# Altium project MDK_UltraZohm_Adapter.PrjPcb
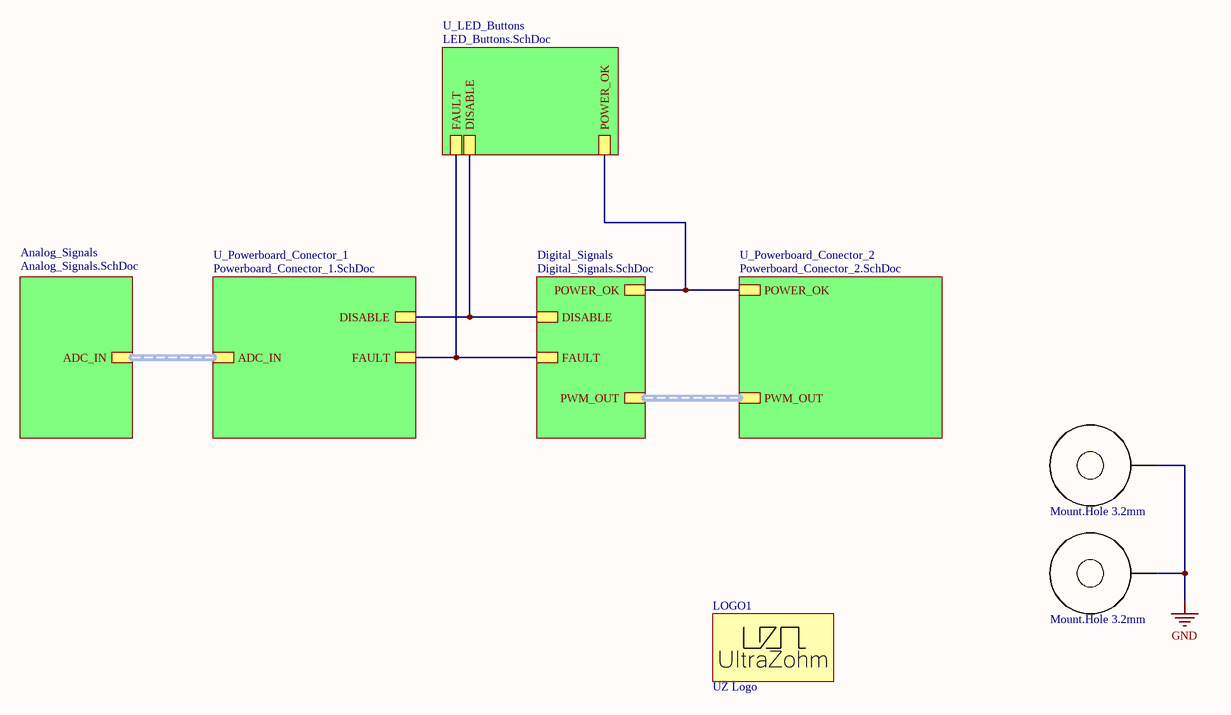
[diagram p0: Interface_Board_Top.SchDoc]
ProjectRevision: Rev02; ProjectName: UZ_OnSemi_Adapter; GlobalAuthor: Eyke Liegmann; GlobalApprovedBy: Daniel Pruna; Date: 03/2021; AuthorParam: Eugen Romaschenko
6 sheets, 41 parts. Net scope: hierarchical (ports join the sheet entries above them; power ports are global).
Board file: MDK_UltraZohm_Adapter.PcbDoc
Sheets:
  Interface_Board_Top.SchDoc
    Analog_Signals = Analog_Signals.SchDoc
    Digital_Signals = Digital_Signals.SchDoc
    U_LED_Buttons = LED_Buttons.SchDoc
    U_Powerboard_Conector_1 = Powerboard_Conector_1.SchDoc
    U_Powerboard_Conector_2 = Powerboard_Conector_2.SchDoc

## Sheet Interface_Board_Top.SchDoc
size A4; Author: Eugen Romaschenko; CompanyName: Technische Hochschule Nürnberg Georg Simon Ohm; Organization: UltraZohm; Address1: Kesslerplatz 12; Address2: 90489 Nürnberg; Address3: GERMANY; DocumentNumber: 1; SheetNumber: 1; SheetTotal: 6; Website: www.ultrazohm.com

### Parts
H1  Mount.Hole 3.2mm  [MHole3_2mm_No_Screw]  (no BOM)
H2  Mount.Hole 3.2mm  [MHole3_2mm_No_Screw]  (no BOM)
LOGO1  UZ Logo  [UZ_Logo_tiny]  (no BOM)

### Sub-sheets
Analog_Signals = Analog_Signals.SchDoc: ADC_IN (harness ADC_IN)
Digital_Signals = Digital_Signals.SchDoc: POWER_OK, FAULT, DISABLE, PWM_OUT (harness PWM_OUT)
U_LED_Buttons = LED_Buttons.SchDoc: POWER_OK, DISABLE, FAULT
U_Powerboard_Conector_1 = Powerboard_Conector_1.SchDoc: FAULT, DISABLE, ADC_IN (harness ADC_IN)
U_Powerboard_Conector_2 = Powerboard_Conector_2.SchDoc: PWM_OUT (harness PWM_OUT), POWER_OK

### Nets
GND: H1.1 H2.1
DISABLE: sheet Digital_Signals/DISABLE, sheet U_LED_Buttons/DISABLE, sheet U_Powerboard_Conector_1/DISABLE
FAULT: sheet Digital_Signals/FAULT, sheet U_LED_Buttons/FAULT, sheet U_Powerboard_Conector_1/FAULT
POWER_OK: sheet Digital_Signals/POWER_OK, sheet U_LED_Buttons/POWER_OK, sheet U_Powerboard_Conector_2/POWER_OK

### Buses and harness runs
harness sheet Analog_Signals/ADC_IN = sheet U_Powerboard_Conector_1/ADC_IN
harness sheet Digital_Signals/PWM_OUT = sheet U_Powerboard_Conector_2/PWM_OUT

### Notes on the sheet
- Title
- Revision:
- Design Engineer:
- Date:
- Project:
- Sheet
- of

### Library data of the parts
H1 H2 = MHole: AN: 22898; Mixed: THT
LOGO1 = UZ Logo: UltraZohm Logo on PCB; Created: Jan2021_Liegmann; Value: UZ Logo

## Sheet Analog_Signals.SchDoc
size A4; Author: Eugen Romaschenko; CompanyName: Technische Hochschule Nürnberg Georg Simon Ohm; Organization: UltraZohm; Address1: Kesslerplatz 12; Address2: 90489 Nürnberg; Address3: GERMANY; DocumentNumber: 2; SheetNumber: 2; SheetTotal: 6; Website: www.ultrazohm.com
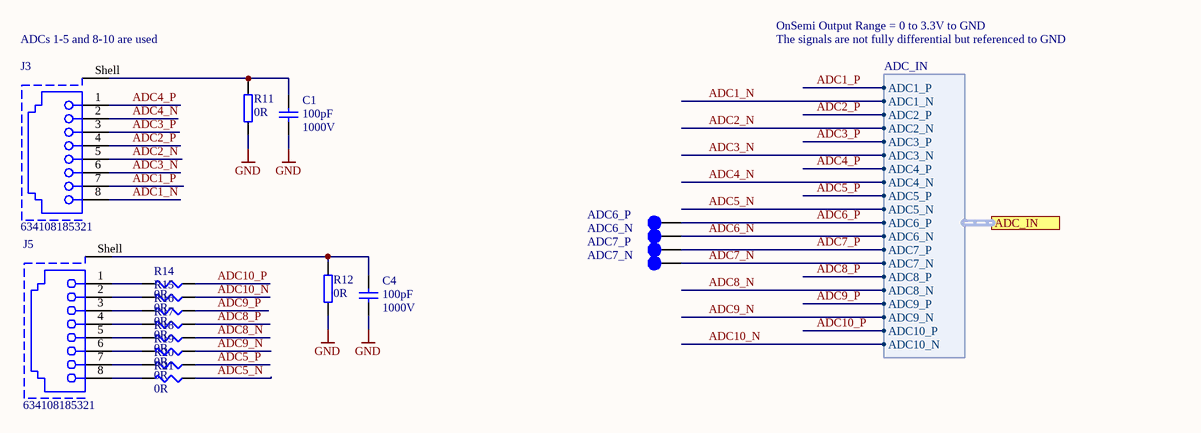
[diagram p1: Analog_Signals.SchDoc]

### Parts
ADC6_N  ADC6_N  [TP_1mm]  (value not drawn)  (no BOM)
ADC6_P  ADC6_P  [TP_1mm]  (value not drawn)  (no BOM)
ADC7_N  ADC7_N  [TP_1mm]  (value not drawn)  (no BOM)
ADC7_P  ADC7_P  [TP_1mm]  (value not drawn)  (no BOM)
C1  100pF  Voltage: 1000V  [C_1206]
C4  100pF  Voltage: 1000V  [C_1206]
J3  634108185321  [634108185321]
J5  634108185321  [634108185321]
R11  0R  [RESC1608X06N]
R12  0R  [RESC1608X06N]
R14  0R  [RESC0603]
R15  0R  [RESC0603]
R16  0R  [RESC0603]
R17  0R  [RESC0603]
R18  0R  [RESC0603]
R19  0R  [RESC0603]
R20  0R  [RESC0603]
R21  0R  [RESC0603]

### Ports
ADC_IN (harness ADC_IN)

### Harnesses
ADC_IN: ADC10_N, ADC10_P, ADC1_N, ADC1_P, ADC2_N, ADC2_P, ADC3_N, ADC3_P, ADC4_N, ADC4_P, ADC5_N, ADC5_P, ADC6_N, ADC6_P, ADC7_N, ADC7_P, ADC8_N, ADC8_P, ADC9_N, ADC9_P

### Nets
GND: C1.1 C4.1 R11.1 R12.1
ADC1_N: J3.8 ; port ADC_IN.ADC1_N
ADC1_P: J3.7 ; port ADC_IN.ADC1_P
ADC2_N: J3.5 ; port ADC_IN.ADC2_N
ADC2_P: J3.4 ; port ADC_IN.ADC2_P
ADC3_N: J3.6 ; port ADC_IN.ADC3_N
ADC3_P: J3.3 ; port ADC_IN.ADC3_P
ADC4_N: J3.2 ; port ADC_IN.ADC4_N
ADC4_P: J3.1 ; port ADC_IN.ADC4_P
ADC5_N: R21.1 ; port ADC_IN.ADC5_N
ADC5_P: R20.1 ; port ADC_IN.ADC5_P
ADC6_N: ADC6_N.1 ; port ADC_IN.ADC6_N
ADC6_P: ADC6_P.1 ; port ADC_IN.ADC6_P
ADC7_N: ADC7_N.1 ; port ADC_IN.ADC7_N
ADC7_P: ADC7_P.1 ; port ADC_IN.ADC7_P
ADC8_N: R18.1 ; port ADC_IN.ADC8_N
ADC8_P: R17.1 ; port ADC_IN.ADC8_P
ADC9_N: R19.1 ; port ADC_IN.ADC9_N
ADC9_P: R16.1 ; port ADC_IN.ADC9_P
ADC10_N: R15.1 ; port ADC_IN.ADC10_N
ADC10_P: R14.1 ; port ADC_IN.ADC10_P
NetC1_2: C1.2 J3.Shell R11.2
NetC4_2: C4.2 J5.Shell R12.2
NetJ5_1: J5.1 R14.2
NetJ5_2: J5.2 R15.2
NetJ5_3: J5.3 R16.2
NetJ5_4: J5.4 R17.2
NetJ5_5: J5.5 R18.2
NetJ5_6: J5.6 R19.2
NetJ5_7: J5.7 R20.2
NetJ5_8: J5.8 R21.2

### Notes on the sheet
- (near J3) ADCs 1-5 and 8-10 are used
- OnSemi Output Range = 0 to 3.3V to GND
- The signals are not fully differential but referenced to GND
- Title
- Revision:
- Design Engineer:
- Date:
- Project:
- Sheet
- of

### Library data of the parts
ADC6_N ADC6_P ADC7_N ADC7_P = TP_1mm: Testpoint 1mm; Created: 2018_06_25_AGeiger; Value: Testpoint 1mm
C1 C4 = C_1206: Capacitor 1206; MPN: 885342008009; Tolerance: 5%; MF: Würth Elektronik; Dielectric: C0G; Package: 1206; Value: 100pF; Created: 2018_06_25_AGeiger; Supplier 1: Mouser; Supplier Part Number 1: 710-885342008009
J3 J5 = 634108185321: WR-MJ Modular Jack SMT Vertical Shielded with Solder Tab 8P8C Top Entry; Manufacturer: Wurth Elektronik; Rated Current: 1.5A; Contact Resistance: 30mOhm; Insulation Resistance: 1000MOhm; Working Voltage: 125VAC; Withstanding Voltage: 1000VAC; ComponentLink1Description: Manufacturer; ComponentLink1URL: http://www.we-online.de; ComponentLink2Description: Datasheet; ComponentLink2URL: https://katalog.we-online.com/em/datasheet/634108185321.pdf; Packaging: Tape and Reel; Mounting Technology: SMT; Operating Temperature: -40 to +85degC; Manufacturer Part Number: 634108185321; Published Date: September 2020; xPxC: 8P8C; Type: Vertical
R11 R12 = R_0603: MPN: CRCW06031M00FKEAC; MF: Vishay / Dale; Tolerance: 1%; Value: 0R; Supplier 1: mouser; Supplier Part Number 1: 71-CRCW06031M00FKEAC; Package: 0603
R14-R21 = RES_SMD: RES SMD; Part Number: Generic 1% tol.; VALUE: 0R; Publisher: Generic

## Sheet Digital_Signals.SchDoc
size A4; Author: Eugen Romaschenko; CompanyName: Technische Hochschule Nürnberg Georg Simon Ohm; Organization: UltraZohm; Address1: Kesslerplatz 12; Address2: 90489 Nürnberg; Address3: GERMANY; DocumentNumber: 3; SheetNumber: 4; SheetTotal: 6; Website: www.ultrazohm.com
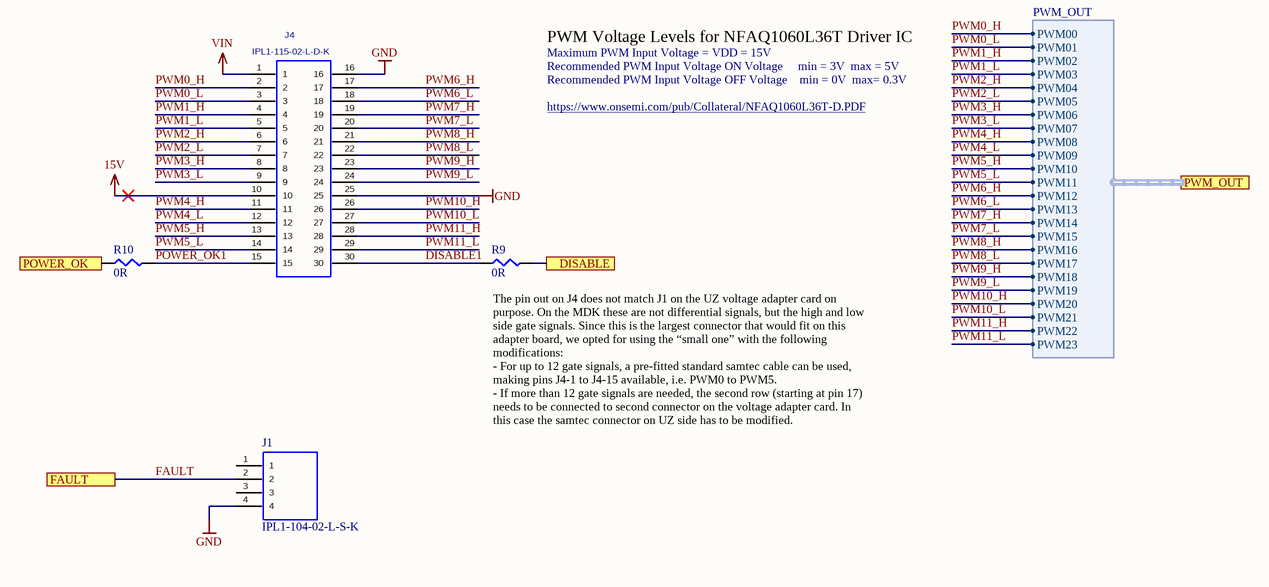
[diagram p2: Digital_Signals.SchDoc]

### Parts
J1  IPL1-104-02-L-S-K  [IPL1-104-02-L-S-K]
J4  IPL1-115-02-L-D-K  [IPL1-115-02-L-D-K]
R9  0R  [RESC0603]
R10  0R  [RESC0603]

### Ports
DISABLE, FAULT, POWER_OK, PWM_OUT (harness PWM_OUT)

### Harnesses
PWM_OUT: PWM00, PWM01, PWM02, PWM03, PWM04, PWM05, PWM06, PWM07, PWM08, PWM09, PWM10, PWM11, PWM12, PWM13, PWM14, PWM15, PWM16, PWM17, PWM18, PWM19, PWM20, PWM21, PWM22, PWM23

### Nets
15V: J4.10
GND: J1.4 J4.16 J4.25
VIN: J4.1
DISABLE: R9.2 ; port DISABLE
DISABLE1: J4.30 R9.1
FAULT: J1.2 ; port FAULT
POWER_OK: R10.1 ; port POWER_OK
POWER_OK1: J4.15 R10.2
PWM0_H: J4.2 ; port PWM_OUT.PWM00
PWM0_L: J4.3 ; port PWM_OUT.PWM01
PWM1_H: J4.4 ; port PWM_OUT.PWM02
PWM1_L: J4.5 ; port PWM_OUT.PWM03
PWM2_H: J4.6 ; port PWM_OUT.PWM04
PWM2_L: J4.7 ; port PWM_OUT.PWM05
PWM3_H: J4.8 ; port PWM_OUT.PWM06
PWM3_L: J4.9 ; port PWM_OUT.PWM07
PWM4_H: J4.11 ; port PWM_OUT.PWM08
PWM4_L: J4.12 ; port PWM_OUT.PWM09
PWM5_H: J4.13 ; port PWM_OUT.PWM10
PWM5_L: J4.14 ; port PWM_OUT.PWM11
PWM6_H: J4.17 ; port PWM_OUT.PWM12
PWM6_L: J4.18 ; port PWM_OUT.PWM13
PWM7_H: J4.19 ; port PWM_OUT.PWM14
PWM7_L: J4.20 ; port PWM_OUT.PWM15
PWM8_H: J4.21 ; port PWM_OUT.PWM16
PWM8_L: J4.22 ; port PWM_OUT.PWM17
PWM9_H: J4.23 ; port PWM_OUT.PWM18
PWM9_L: J4.24 ; port PWM_OUT.PWM19
PWM10_H: J4.26 ; port PWM_OUT.PWM20
PWM10_L: J4.27 ; port PWM_OUT.PWM21
PWM11_H: J4.28 ; port PWM_OUT.PWM22
PWM11_L: J4.29 ; port PWM_OUT.PWM23

Not connected (* = marked no-connect by the designer): J1 1 3

### Notes on the sheet
- PWM Voltage Levels for NFAQ1060L36T Driver IC
- Maximum PWM Input Voltage = VDD = 15V
- Recommended PWM Input Voltage OFF Voltage    min = 0V  max= 0.3V
- Recommended PWM Input Voltage ON Voltage     min = 3V  max = 5V
- https://www.onsemi.com/pub/Collateral/NFAQ1060L36T-D.PDF
- (near R9) The pin out on J4 does not match J1 on the UZ voltage adapter card on purpose. On the MDK these are not differential signals, but the high and low side gate signals. Since this is the largest connector that would fit on this adapter board, we opted for using the “small one” with the following modifications:
  - For up to 12 gate signals, a pre-fitted standard samtec cable can be used, making pins J4-1 to J4-15 available, i.e. PWM0 to PWM5.
  - If more than 12 gate signals are needed, the second row (starting at pin 17) needs to be connected to second connector on the voltage adapter card. In this case the samtec connector on UZ side has to be modified.
- Title
- Revision:
- Design Engineer:
- Date:
- Project:
- Sheet
- of

### Library data of the parts
J4 = IPL1-115-01-XX-D-RA: Terminal Assembly, Double Row, Right Angle, Thru-Hole, 0.100" x 0.100" Pitch, 30 Pins.; MPN: IPL1-115-01-L-D-RA-K; MF: SAMTEC; Created: 2019-12-17_Wendy_Xin; HelpURL: https://www.samtec.com/products/ipl1; ComponentLink1Description: Datasheet; ComponentLink1URL: http://suddendocs.samtec.com/catalog_english/ipl1.pdf; Package: IPL1-115-02-L-D-K; Supplier 2: Farnell; Supplier Part Number 2: 2018467; Supplier 1: Digi-Key; Supplier Part Number 1: SAM9611-ND; Supplier 3: Mouser; Supplier Part Number 3: 200-IPL111501LDRAK
R9 R10 = RES_SMD: RES SMD; Part Number: Generic 1% tol.; VALUE: 0R; Publisher: Generic
J1 = IPL1-104-02-L-S-K: URL: https://www.samtec.com/products/ipl1-104-02-l-s-k#models

## Sheet LED_Buttons.SchDoc
size A4; Author: Eugen Romaschenko; CompanyName: Technische Hochschule Nürnberg Georg Simon Ohm; Organization: UltraZohm; Address1: Kesslerplatz 12; Address2: 90489 Nürnberg; Address3: GERMANY; DocumentNumber: 4; SheetNumber: 3; SheetTotal: 6; Website: www.ultrazohm.com
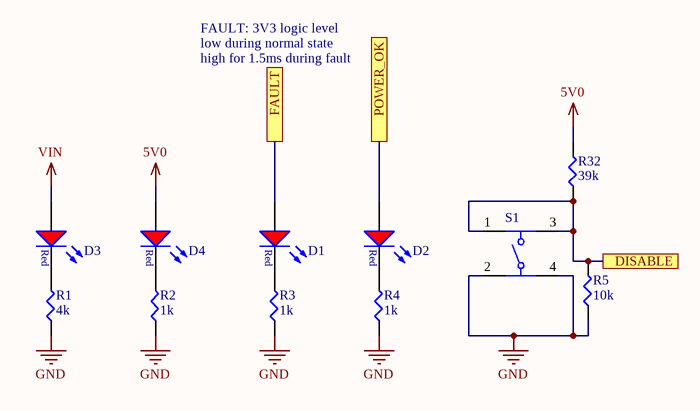
[diagram p3: LED_Buttons.SchDoc]

### Parts
D1  150060RS75000  [WL-SMCW_0603]  (value not drawn)
D2  150060RS75000  [WL-SMCW_0603]  (value not drawn)
D3  150060RS75000  [WL-SMCW_0603]  (value not drawn)
D4  150060RS75000  [WL-SMCW_0603]  (value not drawn)
R1  4k  [RESC0603]
R2  1k  [RESC0603]
R3  1k  [RESC0603]
R4  1k  [RESC0603]
R5  10k  [RESC0603]
R32  39k  [RESC0603]
S1  434153017835  [434153017835]  (value not drawn)

### Ports
DISABLE, FAULT, POWER_OK

### Nets
5V0: D4.2(A) R32.2
GND: R1.1 R2.1 R3.1 R4.1 R5.1 S1.2 S1.4
VIN: D3.2(A)
DISABLE: R5.2 R32.1 S1.1 S1.3 ; port DISABLE
FAULT: D1.2(A) ; port FAULT
POWER_OK: D2.2(A) ; port POWER_OK
NetD1_1: D1.1(K) R3.2
NetD2_1: D2.1(K) R4.2
NetD3_1: D3.1(K) R1.2
NetD4_1: D4.1(K) R2.2

### Notes on the sheet
- FAULT: 3V3 logic level
- low during normal state
- high for 1.5ms during fault
- Title
- Revision:
- Design Engineer:
- Date:
- Project:
- Sheet
- of

### Library data of the parts
D1-D4 = LED_Red_0603: WL-SMCW SMD Mono-color Chip LED Waterclear, size 0603, Red, 2 V, 140°; Forward Voltage: 2 V; Luminous Intensity: 250 mcd; Peak Wavelength: 630 nm; Dominant Wavelength: 625 nm; MF: Wuerth Elektronik; Published Date: Sep. 2017; ComponentLink1Description: Manufacturer; ComponentLink1URL: http://www.we-online.de; ComponentLink2Description: Datasheet; ComponentLink2URL: http://katalog.we-online.com/led/datasheet/150060RS75000.pdf; MPN: 150060RS75000; Size: 0603; Viewing Angle: 140°; Emitting Color: Red; Value: 150060RS75000; Package: 0603; Created: 2018_09_06_AGeiger; Supplier 1: Farnell; Supplier Part Number 1: 2322071; Supplier 2: Mouser; Supplier Part Number 2: 710-150060RS75000; Supplier 3: Digi-Key; Supplier Part Number 3: 732-4978-1-ND
R1-R5 R32 = RES_SMD: RES SMD; Part Number: Generic 1% tol.; Publisher: Generic
  R1: VALUE: 4k
  R2-R4: VALUE: 1k
  R5: VALUE: 10k
  R32: VALUE: 39k
S1 = 434153017835: WS-TASV J-Bend SMT Tact Switch 3.5x2.9mm, height 1.7mm, 350gf; Rated Voltage: 12VDC; Rated Current: 50mA; Washable: No; ComponentLink1Description: Manufacturer; ComponentLink1URL: http://www.we-online.de; ComponentLink2Description: Datasheet; ComponentLink2URL: https://katalog.we-online.com/em/datasheet/434153017835.pdf; Operating Temperature: -40 to +85degC; Part Number: 434153017835; Published Date: September 2019; Contact Material: Stainless Steel; Height: 1.7mm; Mounting Technology: SMT; Contact Plating: Silver; Operation Force: 350gf; Packaging: Tape and Reel; Terminal Material: Copper Alloy; Publisher: Wurth Elektronik; Terminal Plating: Silver

## Sheet Powerboard_Conector_1.SchDoc
size A4; Author: Eugen Romaschenko; CompanyName: Technische Hochschule Nürnberg Georg Simon Ohm; Organization: UltraZohm; Address1: Kesslerplatz 12; Address2: 90489 Nürnberg; Address3: GERMANY; DocumentNumber: 5; SheetNumber: 5; SheetTotal: 6; Website: www.ultrazohm.com
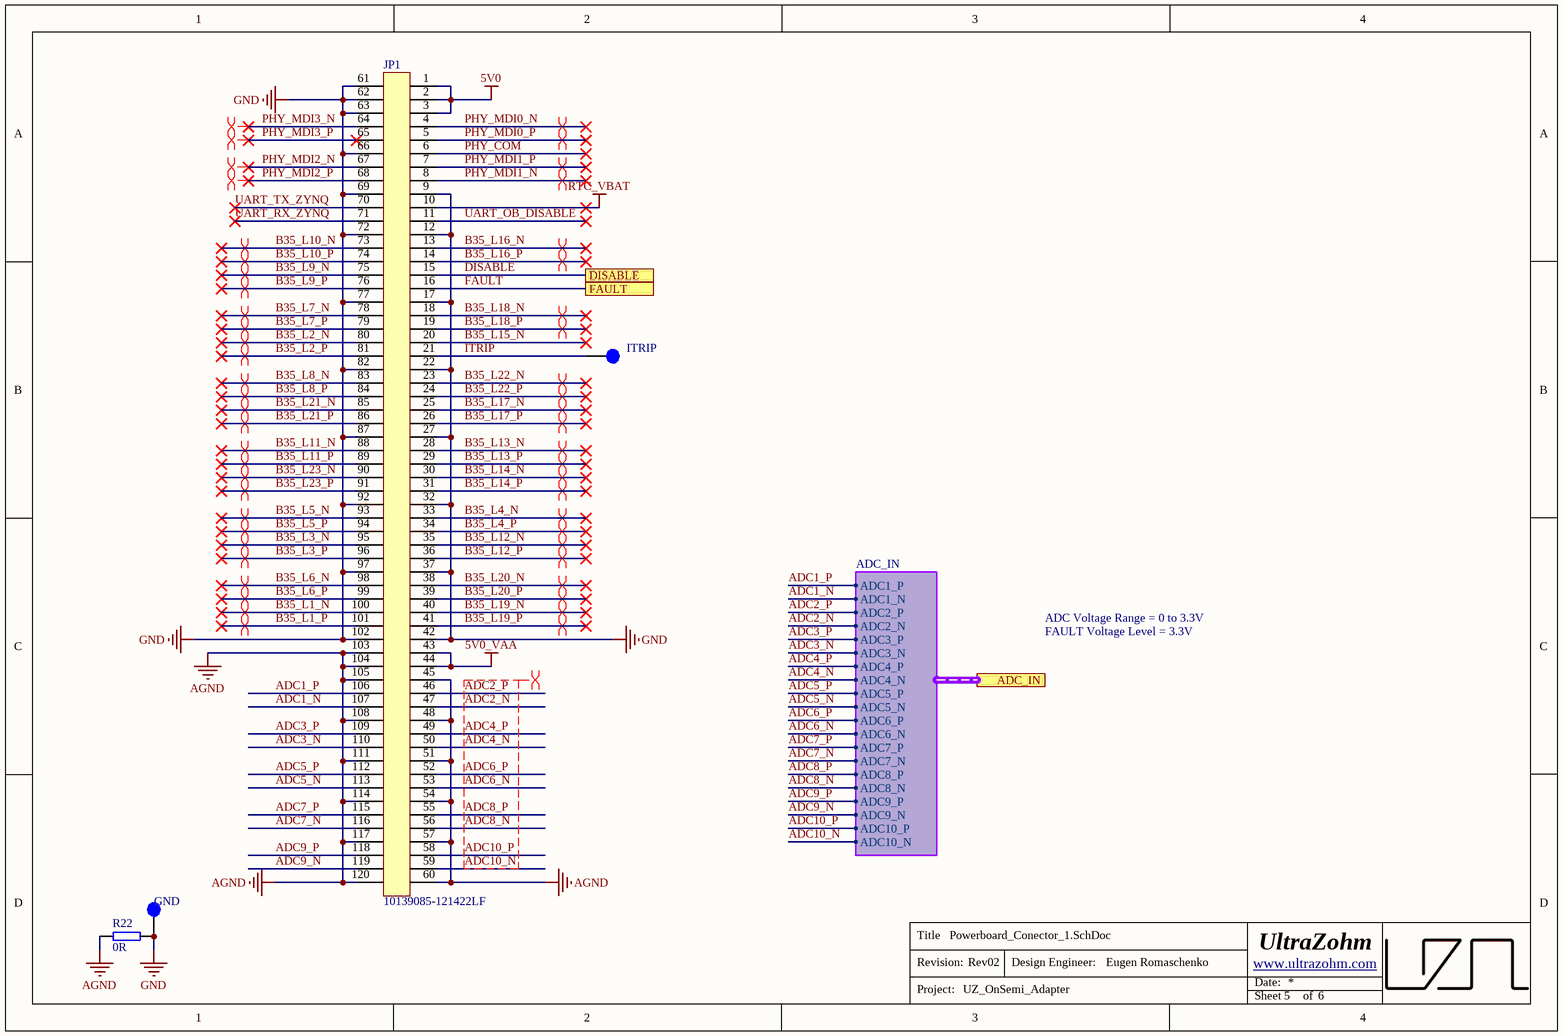
[diagram p4: Powerboard_Conector_1.SchDoc]

### Parts
GND  GND  [TP_1mm]  (value not drawn)  (no BOM)
ITRIP  ITRIP  [TP_1mm]  (value not drawn)  (no BOM)
JP1  10139085-121422LF  [10139085-121422LF]
R22  0R  [RESC1608X06N]

### Ports
ADC_IN (harness ADC_IN), DISABLE, FAULT

### Harnesses
ADC_IN: ADC1_P, ADC2_P, ADC3_P, ADC4_P, ADC5_P, ADC6_P, ADC7_P, ADC8_P, ADC9_P, ADC1_N, ADC2_N, ADC3_N, ADC4_N, ADC5_N, ADC6_N, ADC7_N, ADC8_N, ADC9_N, ADC10_P, ADC10_N

### Nets
5V0: JP1.1 JP1.2 JP1.3
5V0_VAA: JP1.43 JP1.44
AGND: JP1.45 JP1.48 JP1.51 JP1.54 JP1.57 JP1.60 JP1.103 JP1.104 JP1.105 JP1.108 JP1.111 JP1.114 JP1.117 JP1.120 R22.2
GND: GND.1 JP1.9 JP1.12 JP1.17 JP1.22 JP1.27 JP1.32 JP1.37 JP1.42 JP1.61 JP1.62 JP1.63 JP1.66 JP1.69 JP1.72 JP1.77 JP1.82 JP1.87 JP1.92 JP1.97 JP1.102 R22.1
RTC_VBAT: JP1.10
ADC1_N: JP1.107 ; port ADC_IN.ADC1_N
ADC1_P: JP1.106 ; port ADC_IN.ADC1_P
ADC2_N: JP1.47 ; port ADC_IN.ADC2_N
ADC2_P: JP1.46 ; port ADC_IN.ADC2_P
ADC3_N: JP1.110 ; port ADC_IN.ADC3_N
ADC3_P: JP1.109 ; port ADC_IN.ADC3_P
ADC4_N: JP1.50 ; port ADC_IN.ADC4_N
ADC4_P: JP1.49 ; port ADC_IN.ADC4_P
ADC5_N: JP1.113 ; port ADC_IN.ADC5_N
ADC5_P: JP1.112 ; port ADC_IN.ADC5_P
ADC6_N: JP1.53 ; port ADC_IN.ADC6_N
ADC6_P: JP1.52 ; port ADC_IN.ADC6_P
ADC7_N: JP1.116 ; port ADC_IN.ADC7_N
ADC7_P: JP1.115 ; port ADC_IN.ADC7_P
ADC8_N: JP1.56 ; port ADC_IN.ADC8_N
ADC8_P: JP1.55 ; port ADC_IN.ADC8_P
ADC9_N: JP1.119 ; port ADC_IN.ADC9_N
ADC9_P: JP1.118 ; port ADC_IN.ADC9_P
ADC10_N: JP1.59 ; port ADC_IN.ADC10_N
ADC10_P: JP1.58 ; port ADC_IN.ADC10_P
B35_L1_N: JP1.100
B35_L1_P: JP1.101
B35_L2_N: JP1.80
B35_L2_P: JP1.81
B35_L3_N: JP1.95
B35_L3_P: JP1.96
B35_L4_N: JP1.33
B35_L4_P: JP1.34
B35_L5_N: JP1.93
B35_L5_P: JP1.94
B35_L6_N: JP1.98
B35_L6_P: JP1.99
B35_L7_N: JP1.78
B35_L7_P: JP1.79
B35_L8_N: JP1.83
B35_L8_P: JP1.84
B35_L9_N: JP1.75
B35_L9_P: JP1.76
B35_L10_N: JP1.73
B35_L10_P: JP1.74
B35_L11_N: JP1.88
B35_L11_P: JP1.89
B35_L12_N: JP1.35
B35_L12_P: JP1.36
B35_L13_N: JP1.28
B35_L13_P: JP1.29
B35_L14_N: JP1.30
B35_L14_P: JP1.31
B35_L15_N: JP1.20
B35_L16_N: JP1.13
B35_L16_P: JP1.14
B35_L17_N: JP1.25
B35_L17_P: JP1.26
B35_L18_N: JP1.18
B35_L18_P: JP1.19
B35_L19_N: JP1.40
B35_L19_P: JP1.41
B35_L20_N: JP1.38
B35_L20_P: JP1.39
B35_L21_N: JP1.85
B35_L21_P: JP1.86
B35_L22_N: JP1.23
B35_L22_P: JP1.24
B35_L23_N: JP1.90
B35_L23_P: JP1.91
DISABLE: JP1.15 ; port DISABLE
FAULT: JP1.16 ; port FAULT
ITRIP: ITRIP.1 JP1.21
PHY_COM: JP1.6
PHY_MDI0_N: JP1.4
PHY_MDI0_P: JP1.5
PHY_MDI1_N: JP1.8
PHY_MDI1_P: JP1.7
PHY_MDI2_N: JP1.67
PHY_MDI2_P: JP1.68
PHY_MDI3_N: JP1.64
PHY_MDI3_P: JP1.65
UART_OB_DISABLE: JP1.11
UART_RX_ZYNQ: JP1.71
UART_TX_ZYNQ: JP1.70

### Layout directives
differential pair: ADC2_N, ADC2_P, ADC4_N, ADC4_P, ADC6_N, ADC6_P, ADC8_N, ADC8_P, ADC10_N, ADC10_P, B35_L1_N, B35_L1_P, B35_L2_N, B35_L2_P, B35_L3_N, B35_L3_P, B35_L4_N, B35_L4_P, B35_L5_N, B35_L5_P, B35_L6_N, B35_L6_P, B35_L7_N, B35_L7_P, B35_L8_N, B35_L8_P, B35_L9_N, B35_L9_P, B35_L10_N, B35_L10_P, B35_L11_N, B35_L11_P, B35_L12_N, B35_L12_P, B35_L13_N, B35_L13_P, B35_L14_N, B35_L14_P, B35_L16_N, B35_L16_P, B35_L17_N, B35_L17_P, B35_L18_N, B35_L18_P, B35_L19_N, B35_L19_P, B35_L20_N, B35_L20_P, B35_L21_N, B35_L21_P, B35_L22_N, B35_L22_P, B35_L23_N, B35_L23_P, PHY_MDI0_N, PHY_MDI0_P, PHY_MDI1_N, PHY_MDI1_P, PHY_MDI2_N, PHY_MDI2_P, PHY_MDI3_N, PHY_MDI3_P

### Notes on the sheet
- ADC Voltage Range = 0 to 3.3V
- FAULT Voltage Level = 3.3V
- Title
- Revision:
- Design Engineer:
- Date:
- Project:
- Sheet
- of

### Library data of the parts
GND ITRIP = TP_1mm: Testpoint 1mm; Created: 2018_06_25_AGeiger; Value: Testpoint 1mm
JP1 = 10139085-121422LF: Bergstack+ 0.8mm pich - 120pin B2B connector; ComponentLink1Description: Webpage; ComponentLink1URL: https://www.amphenol-icc.com/product-series/bergstak-plus-080mm-mezzanine.html; ComponentLink2Description: Datasheet; ComponentLink2URL: https://cdn.amphenol-icc.com/media/wysiwyg/files/documentation/datasheet/boardwiretoboard/bwb_bergstakplus_080mm_mezzanine.pdf; ComponentLink3Description: Component Drawing; ComponentLink3URL: https://cdn.amphenol-icc.com/media/wysiwyg/files/drawing/10139085.pdf; Part Number: 10139085-121422LF; Publisher: Amphenol ICC
R22 = R_0603: as R11 on sheet Analog_Signals; Value: 0R; Supplier 1: mouser; Supplier Part Number 1: 71-CRCW06031M00FKEAC; Package: 0603

## Sheet Powerboard_Conector_2.SchDoc
size A4; Author: Eugen Romaschenko; CompanyName: Technische Hochschule Nürnberg Georg Simon Ohm; Organization: UltraZohm; Address1: Kesslerplatz 12; Address2: 90489 Nürnberg; Address3: GERMANY; DocumentNumber: 6; SheetNumber: 6; SheetTotal: 6; Website: www.ultrazohm.com
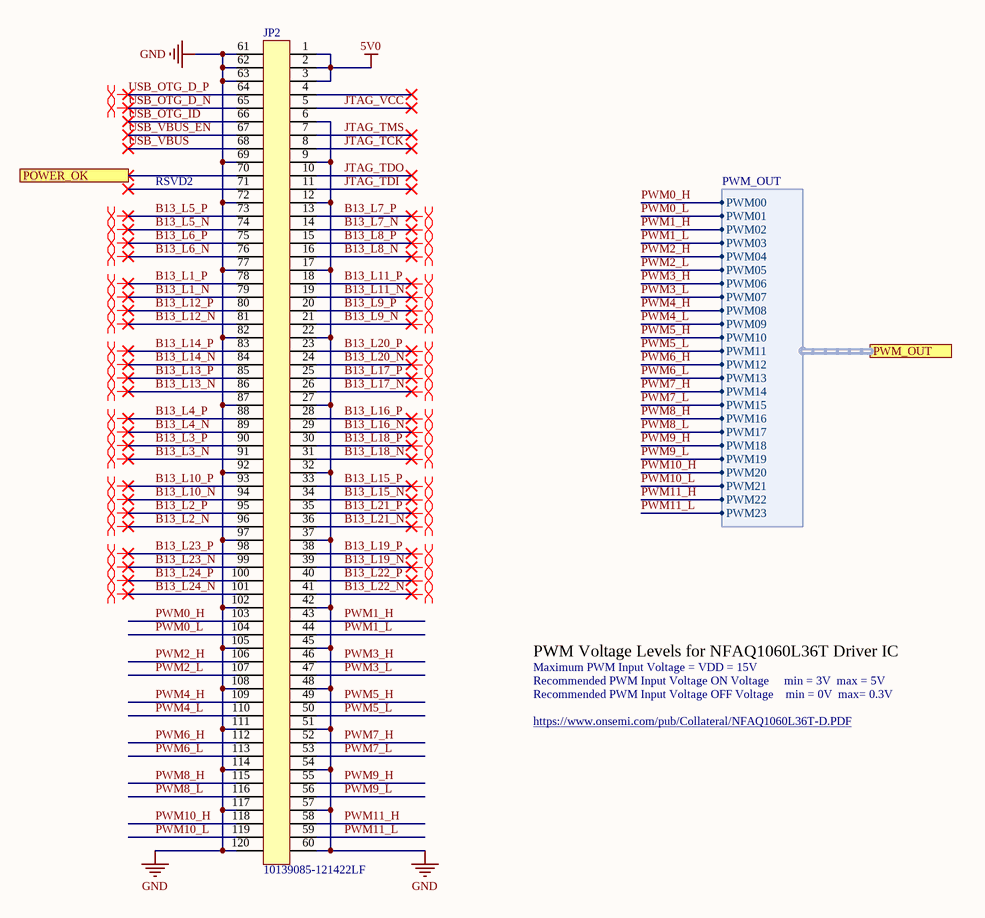
[diagram p5: Powerboard_Conector_2.SchDoc]

### Parts
JP2  10139085-121422LF  [10139085-121422LF]

### Ports
POWER_OK, PWM_OUT (harness PWM_OUT)

### Harnesses
PWM_OUT: PWM00, PWM01, PWM02, PWM03, PWM04, PWM05, PWM06, PWM07, PWM08, PWM09, PWM10, PWM11, PWM12, PWM13, PWM14, PWM15, PWM16, PWM17, PWM18, PWM19, PWM20, PWM21, PWM22, PWM23

### Nets
5V0: JP2.1 JP2.2 JP2.3
GND: JP2.6 JP2.9 JP2.12 JP2.17 JP2.22 JP2.27 JP2.32 JP2.37 JP2.42 JP2.45 JP2.48 JP2.51 JP2.54 JP2.57 JP2.60 JP2.61 JP2.62 JP2.63 JP2.69 JP2.72 JP2.77 JP2.82 JP2.87 JP2.92 JP2.97 JP2.102 JP2.105 JP2.108 JP2.111 JP2.114 JP2.117 JP2.120
B13_L1_N: JP2.79
B13_L1_P: JP2.78
B13_L2_N: JP2.96
B13_L2_P: JP2.95
B13_L3_N: JP2.91
B13_L3_P: JP2.90
B13_L4_N: JP2.89
B13_L4_P: JP2.88
B13_L5_N: JP2.74
B13_L5_P: JP2.73
B13_L6_N: JP2.76
B13_L6_P: JP2.75
B13_L7_N: JP2.14
B13_L7_P: JP2.13
B13_L8_N: JP2.16
B13_L8_P: JP2.15
B13_L9_N: JP2.21
B13_L9_P: JP2.20
B13_L10_N: JP2.94
B13_L10_P: JP2.93
B13_L11_N: JP2.19
B13_L11_P: JP2.18
B13_L12_N: JP2.81
B13_L12_P: JP2.80
B13_L13_N: JP2.86
B13_L13_P: JP2.85
B13_L14_N: JP2.84
B13_L14_P: JP2.83
B13_L15_N: JP2.34
B13_L15_P: JP2.33
B13_L16_N: JP2.29
B13_L16_P: JP2.28
B13_L17_N: JP2.26
B13_L17_P: JP2.25
B13_L18_N: JP2.31
B13_L18_P: JP2.30
B13_L19_N: JP2.39
B13_L19_P: JP2.38
B13_L20_N: JP2.24
B13_L20_P: JP2.23
B13_L21_N: JP2.36
B13_L21_P: JP2.35
B13_L22_N: JP2.41
B13_L22_P: JP2.40
B13_L23_N: JP2.99
B13_L23_P: JP2.98
B13_L24_N: JP2.101
B13_L24_P: JP2.100
JTAG_TCK: JP2.8
JTAG_TDI: JP2.11
JTAG_TDO: JP2.10
JTAG_TMS: JP2.7
JTAG_VCC: JP2.5
POWER_OK: JP2.70 ; port POWER_OK
PWM0_H: JP2.103 ; port PWM_OUT.PWM00
PWM0_L: JP2.104 ; port PWM_OUT.PWM01
PWM1_H: JP2.43 ; port PWM_OUT.PWM02
PWM1_L: JP2.44 ; port PWM_OUT.PWM03
PWM2_H: JP2.106 ; port PWM_OUT.PWM04
PWM2_L: JP2.107 ; port PWM_OUT.PWM05
PWM3_H: JP2.46 ; port PWM_OUT.PWM06
PWM3_L: JP2.47 ; port PWM_OUT.PWM07
PWM4_H: JP2.109 ; port PWM_OUT.PWM08
PWM4_L: JP2.110 ; port PWM_OUT.PWM09
PWM5_H: JP2.49 ; port PWM_OUT.PWM10
PWM5_L: JP2.50 ; port PWM_OUT.PWM11
PWM6_H: JP2.112 ; port PWM_OUT.PWM12
PWM6_L: JP2.113 ; port PWM_OUT.PWM13
PWM7_H: JP2.52 ; port PWM_OUT.PWM14
PWM7_L: JP2.53 ; port PWM_OUT.PWM15
PWM8_H: JP2.115 ; port PWM_OUT.PWM16
PWM8_L: JP2.116 ; port PWM_OUT.PWM17
PWM9_H: JP2.55 ; port PWM_OUT.PWM18
PWM9_L: JP2.56 ; port PWM_OUT.PWM19
PWM10_H: JP2.118 ; port PWM_OUT.PWM20
PWM10_L: JP2.119 ; port PWM_OUT.PWM21
PWM11_H: JP2.58 ; port PWM_OUT.PWM22
PWM11_L: JP2.59 ; port PWM_OUT.PWM23
USB_OTG_D_N: JP2.65
USB_OTG_D_P: JP2.64
USB_OTG_ID: JP2.66
USB_VBUS: JP2.68
USB_VBUS_EN: JP2.67

Not connected (* = marked no-connect by the designer): JP2 4* 71*

### Layout directives
differential pair: B13_L1_N, B13_L1_P, B13_L2_N, B13_L2_P, B13_L3_N, B13_L3_P, B13_L4_N, B13_L4_P, B13_L5_N, B13_L5_P, B13_L6_N, B13_L6_P, B13_L7_N, B13_L7_P, B13_L8_N, B13_L8_P, B13_L9_N, B13_L9_P, B13_L10_N, B13_L10_P, B13_L11_N, B13_L11_P, B13_L12_N, B13_L12_P, B13_L13_N, B13_L13_P, B13_L14_N, B13_L14_P, B13_L15_N, B13_L15_P, B13_L16_N, B13_L16_P, B13_L17_N, B13_L17_P, B13_L18_N, B13_L18_P, B13_L19_N, B13_L19_P, B13_L20_N, B13_L20_P, B13_L21_N, B13_L21_P, B13_L22_N, B13_L22_P, B13_L23_N, B13_L23_P, B13_L24_N, B13_L24_P, USB_OTG_D_N, USB_OTG_D_P

### Notes on the sheet
- RSVD2
- PWM Voltage Levels for NFAQ1060L36T Driver IC
- Maximum PWM Input Voltage = VDD = 15V
- Recommended PWM Input Voltage OFF Voltage    min = 0V  max= 0.3V
- Recommended PWM Input Voltage ON Voltage     min = 3V  max = 5V
- https://www.onsemi.com/pub/Collateral/NFAQ1060L36T-D.PDF
- Title
- Revision:
- Design Engineer:
- Date:
- Project:
- Sheet
- of

### Library data of the parts
JP2 = 10139085-121422LF: as JP1 on sheet Powerboard_Conector_1; ComponentLink1Description: Webpage; ComponentLink1URL: https://www.amphenol-icc.com/product-series/bergstak-plus-080mm-mezzanine.html; ComponentLink2Description: Datasheet; ComponentLink2URL: https://cdn.amphenol-icc.com/media/wysiwyg/files/documentation/datasheet/boardwiretoboard/bwb_bergstakplus_080mm_mezzanine.pdf; ComponentLink3Description: Component Drawing; ComponentLink3URL: https://cdn.amphenol-icc.com/media/wysiwyg/files/drawing/10139085.pdf; Part Number: 10139085-121422LF; Publisher: Amphenol ICC

## Nets that join several sheets
5V0: LED_Buttons (D4.2 R32.2), Powerboard_Conector_1 (JP1.1 JP1.2 JP1.3), Powerboard_Conector_2 (JP2.1 JP2.2 JP2.3)
GND: Interface_Board_Top (H1.1 H2.1), Analog_Signals (C1.1 C4.1 R11.1 R12.1), Digital_Signals (J1.4 J4.16 J4.25), LED_Buttons (7 pins), Powerboard_Conector_1 (22 pins), Powerboard_Conector_2 (32 pins)
VIN: Digital_Signals (J4.1), LED_Buttons (D3.2)
ADC1_N: Analog_Signals (J3.8), Powerboard_Conector_1 (JP1.107)
ADC1_P: Analog_Signals (J3.7), Powerboard_Conector_1 (JP1.106)
ADC2_N: Analog_Signals (J3.5), Powerboard_Conector_1 (JP1.47)
ADC2_P: Analog_Signals (J3.4), Powerboard_Conector_1 (JP1.46)
ADC3_N: Analog_Signals (J3.6), Powerboard_Conector_1 (JP1.110)
ADC3_P: Analog_Signals (J3.3), Powerboard_Conector_1 (JP1.109)
ADC4_N: Analog_Signals (J3.2), Powerboard_Conector_1 (JP1.50)
ADC4_P: Analog_Signals (J3.1), Powerboard_Conector_1 (JP1.49)
ADC5_N: Analog_Signals (R21.1), Powerboard_Conector_1 (JP1.113)
ADC5_P: Analog_Signals (R20.1), Powerboard_Conector_1 (JP1.112)
ADC6_N: Analog_Signals (ADC6_N.1), Powerboard_Conector_1 (JP1.53)
ADC6_P: Analog_Signals (ADC6_P.1), Powerboard_Conector_1 (JP1.52)
ADC7_N: Analog_Signals (ADC7_N.1), Powerboard_Conector_1 (JP1.116)
ADC7_P: Analog_Signals (ADC7_P.1), Powerboard_Conector_1 (JP1.115)
ADC8_N: Analog_Signals (R18.1), Powerboard_Conector_1 (JP1.56)
ADC8_P: Analog_Signals (R17.1), Powerboard_Conector_1 (JP1.55)
ADC9_N: Analog_Signals (R19.1), Powerboard_Conector_1 (JP1.119)
ADC9_P: Analog_Signals (R16.1), Powerboard_Conector_1 (JP1.118)
ADC10_N: Analog_Signals (R15.1), Powerboard_Conector_1 (JP1.59)
ADC10_P: Analog_Signals (R14.1), Powerboard_Conector_1 (JP1.58)
DISABLE: Digital_Signals (R9.2), LED_Buttons (R5.2 R32.1 S1.1 S1.3), Powerboard_Conector_1 (JP1.15)
FAULT: Digital_Signals (J1.2), LED_Buttons (D1.2), Powerboard_Conector_1 (JP1.16)
POWER_OK: Digital_Signals (R10.1), LED_Buttons (D2.2), Powerboard_Conector_2 (JP2.70)
PWM0_H: Digital_Signals (J4.2), Powerboard_Conector_2 (JP2.103)
PWM0_L: Digital_Signals (J4.3), Powerboard_Conector_2 (JP2.104)
PWM1_H: Digital_Signals (J4.4), Powerboard_Conector_2 (JP2.43)
PWM1_L: Digital_Signals (J4.5), Powerboard_Conector_2 (JP2.44)
PWM2_H: Digital_Signals (J4.6), Powerboard_Conector_2 (JP2.106)
PWM2_L: Digital_Signals (J4.7), Powerboard_Conector_2 (JP2.107)
PWM3_H: Digital_Signals (J4.8), Powerboard_Conector_2 (JP2.46)
PWM3_L: Digital_Signals (J4.9), Powerboard_Conector_2 (JP2.47)
PWM4_H: Digital_Signals (J4.11), Powerboard_Conector_2 (JP2.109)
PWM4_L: Digital_Signals (J4.12), Powerboard_Conector_2 (JP2.110)
PWM5_H: Digital_Signals (J4.13), Powerboard_Conector_2 (JP2.49)
PWM5_L: Digital_Signals (J4.14), Powerboard_Conector_2 (JP2.50)
PWM6_H: Digital_Signals (J4.17), Powerboard_Conector_2 (JP2.112)
PWM6_L: Digital_Signals (J4.18), Powerboard_Conector_2 (JP2.113)
PWM7_H: Digital_Signals (J4.19), Powerboard_Conector_2 (JP2.52)
PWM7_L: Digital_Signals (J4.20), Powerboard_Conector_2 (JP2.53)
PWM8_H: Digital_Signals (J4.21), Powerboard_Conector_2 (JP2.115)
PWM8_L: Digital_Signals (J4.22), Powerboard_Conector_2 (JP2.116)
PWM9_H: Digital_Signals (J4.23), Powerboard_Conector_2 (JP2.55)
PWM9_L: Digital_Signals (J4.24), Powerboard_Conector_2 (JP2.56)
PWM10_H: Digital_Signals (J4.26), Powerboard_Conector_2 (JP2.118)
PWM10_L: Digital_Signals (J4.27), Powerboard_Conector_2 (JP2.119)
PWM11_H: Digital_Signals (J4.28), Powerboard_Conector_2 (JP2.58)
PWM11_L: Digital_Signals (J4.29), Powerboard_Conector_2 (JP2.59)

## Assembly variants
Standard: not fitted C1 C4